# EAGLE design motortreiber (EAGLE 7.5.0)
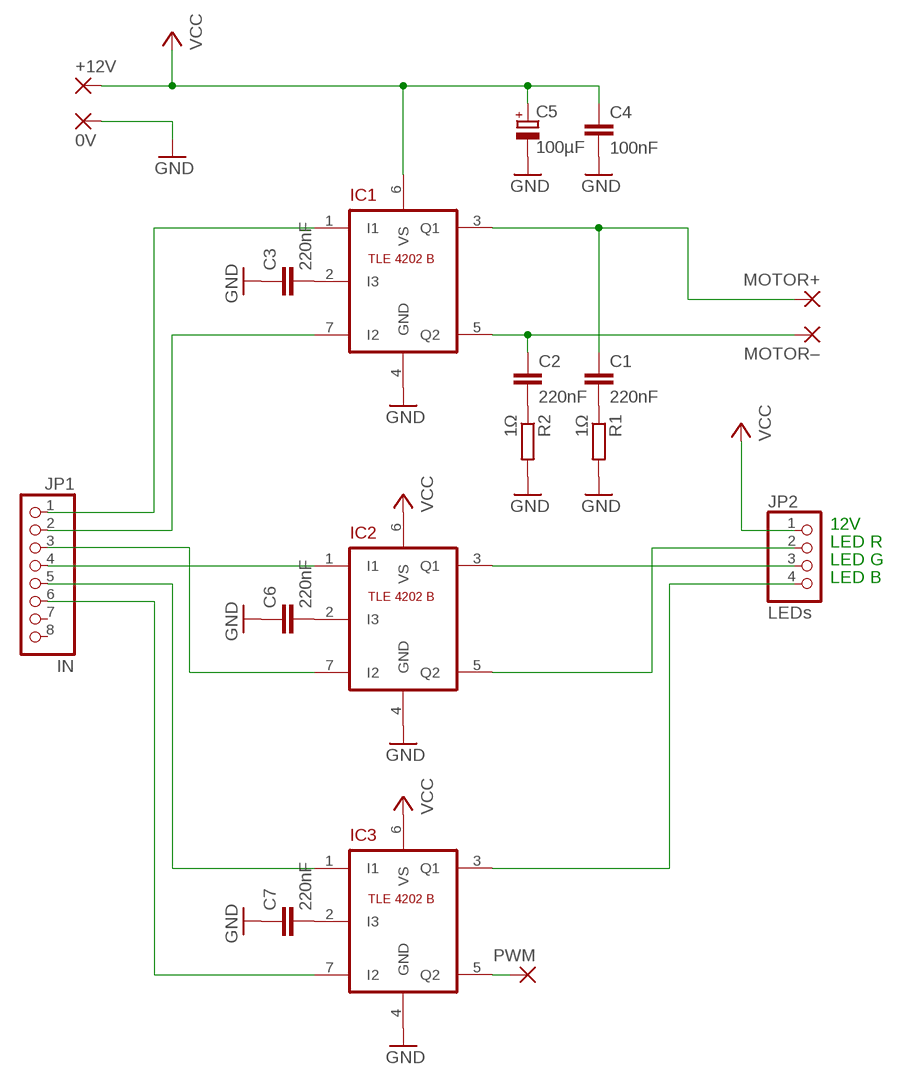
[diagram p0: schematic, sheet 1]

## Parts
0V  WIREPAD2,15/1,0  [2,15/1,0]
+12V  WIREPAD2,15/1,0  [2,15/1,0]
C1  220nF  C5/2.5  [C5B2.5]
C2  220nF  C5/2.5  [C5B2.5]
C3  220nF  C5/2.5  [C5B2.5]
C4  100nF  C2,5-3  [C2.5-3]
C5  100µF  CPOL-EUE2.5-5  [E2,5-5]
C6  220nF  C5/2.5  [C5B2.5]
C7  220nF  C5/2.5  [C5B2.5]
IC1  TLE-4202-B-100MIL  [TO-220-7-BREADBOARD]
IC2  TLE-4202-B-100MIL  [TO-220-7-BREADBOARD]
IC3  TLE-4202-B-100MIL  [TO-220-7-BREADBOARD]
JP1  IN  PINHD-1X8  [1X08]
JP2  LEDs  PINHD-1X4  [1X04]
MOTOR+  WIREPAD2,15/1,0  [2,15/1,0]
MOTOR–  WIREPAD2,15/1,0  [2,15/1,0]
PWM  WIREPAD2,15/1,0  [2,15/1,0]
R1  1Ω  R-EU_0204/7  [0204/7]
R2  1Ω  R-EU_0204/7  [0204/7]

## Nets
GND: 0V.1(P) C3.1 C4.2 C5.- C6.1 C7.1 IC1.4(GND) IC2.4(GND) IC3.4(GND) R1.2 R2.2
N$1: C1.1 IC1.3(Q1) MOTOR+.1(P)
N$2: C2.1 IC1.5(Q2) MOTOR–.1(P)
N$3: C3.2 IC1.2(I3)
N$4: IC1.1(I1) JP1.1
N$5: IC1.7(I2) JP1.2
N$6: C1.2 R1.1
N$7: C2.2 R2.1
N$8: IC2.1(I1) JP1.4
N$9: IC3.7(I2) JP1.6
N$10: IC3.1(I1) JP1.5
N$11: IC2.7(I2) JP1.3
N$12: C6.2 IC2.2(I3)
N$13: C7.2 IC3.2(I3)
N$17: IC3.5(Q2) PWM.1(P)
N$BOUT: IC3.3(Q1) JP2.4
N$GOUT: IC2.3(Q1) JP2.3
N$ROUT: IC2.5(Q2) JP2.2
VCC: +12V.1(P) C4.1 C5.+ IC1.6(VS) IC2.6(VS) IC3.6(VS) JP2.1
Unconnected: JP1.7 JP1.8

## Notes on the sheet
- 12V
- LED R
- LED G
- LED B

## Library data of the parts
0V +12V MOTOR+ MOTOR– PWM = wirepad:WIREPAD: Wire PAD connect wire on PCB
C1-C4 C6 C7 = capacitor-wima:C: CAPACITOR naming: grid - package width
C5 = rcl:CPOL-EU: POLARIZED CAPACITOR, European symbol
IC1-IC3 = siemens-tle-4202-b:TLE-4202-B: Siemens TLE 4202 B 2-A DC Motor Driver Data sheet (pollin.de) <http://www.pollin.de/shop/downloads/D101044D.PDF>
JP1 = pinhead:PINHD-1X8: PIN HEADER
JP2 = pinhead:PINHD-1X4: PIN HEADER
R1 R2 = resistor:R-EU_: RESISTOR, European symbol

## Board
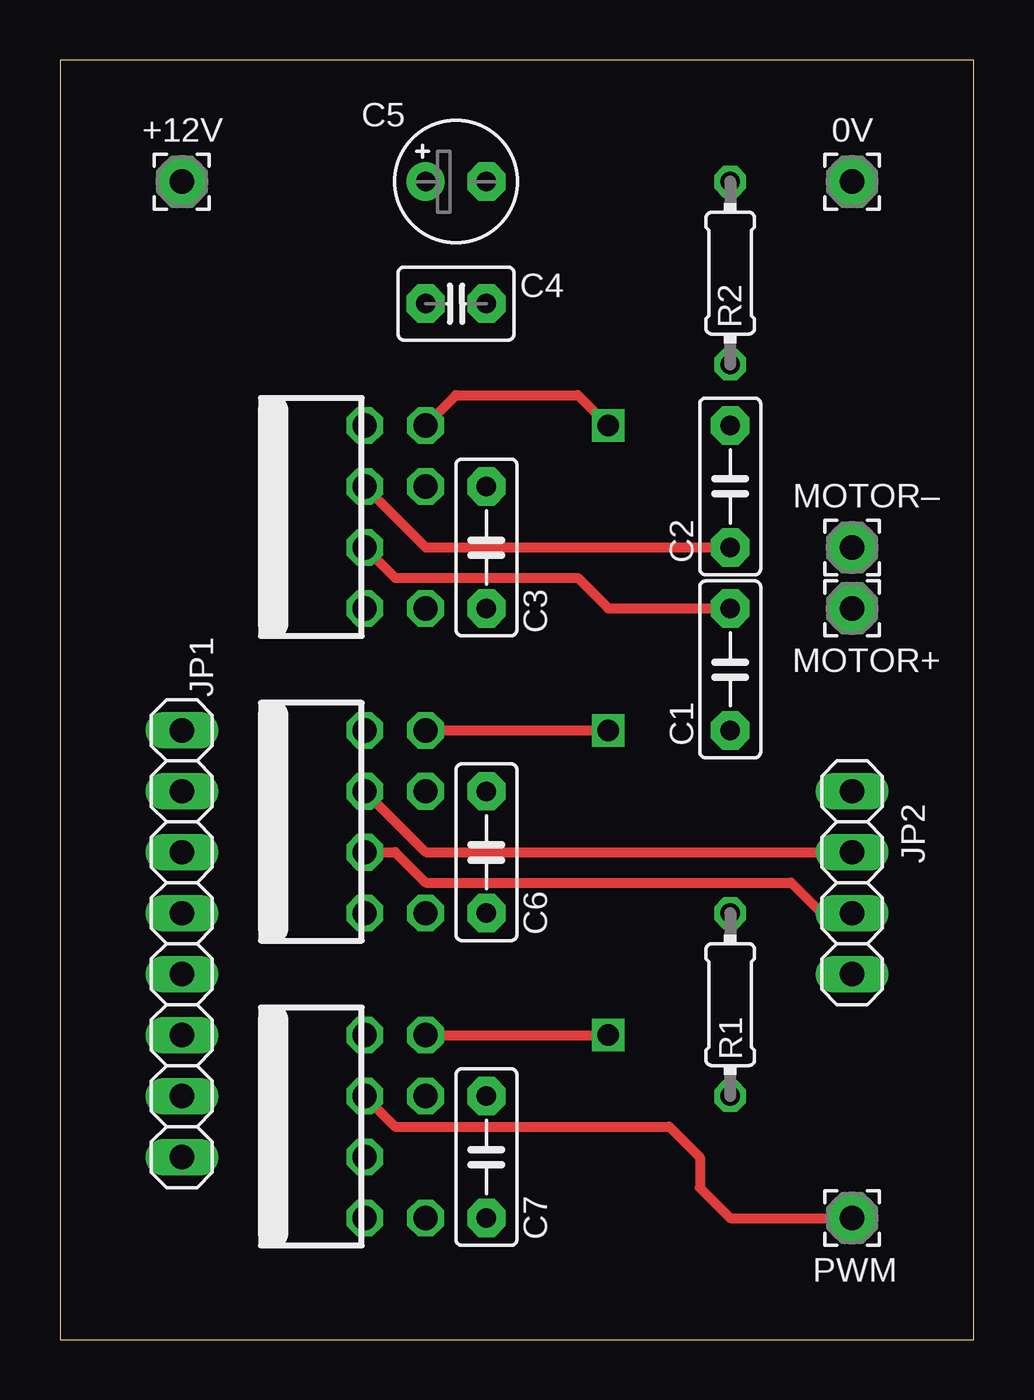
[diagram p1: board, top side]
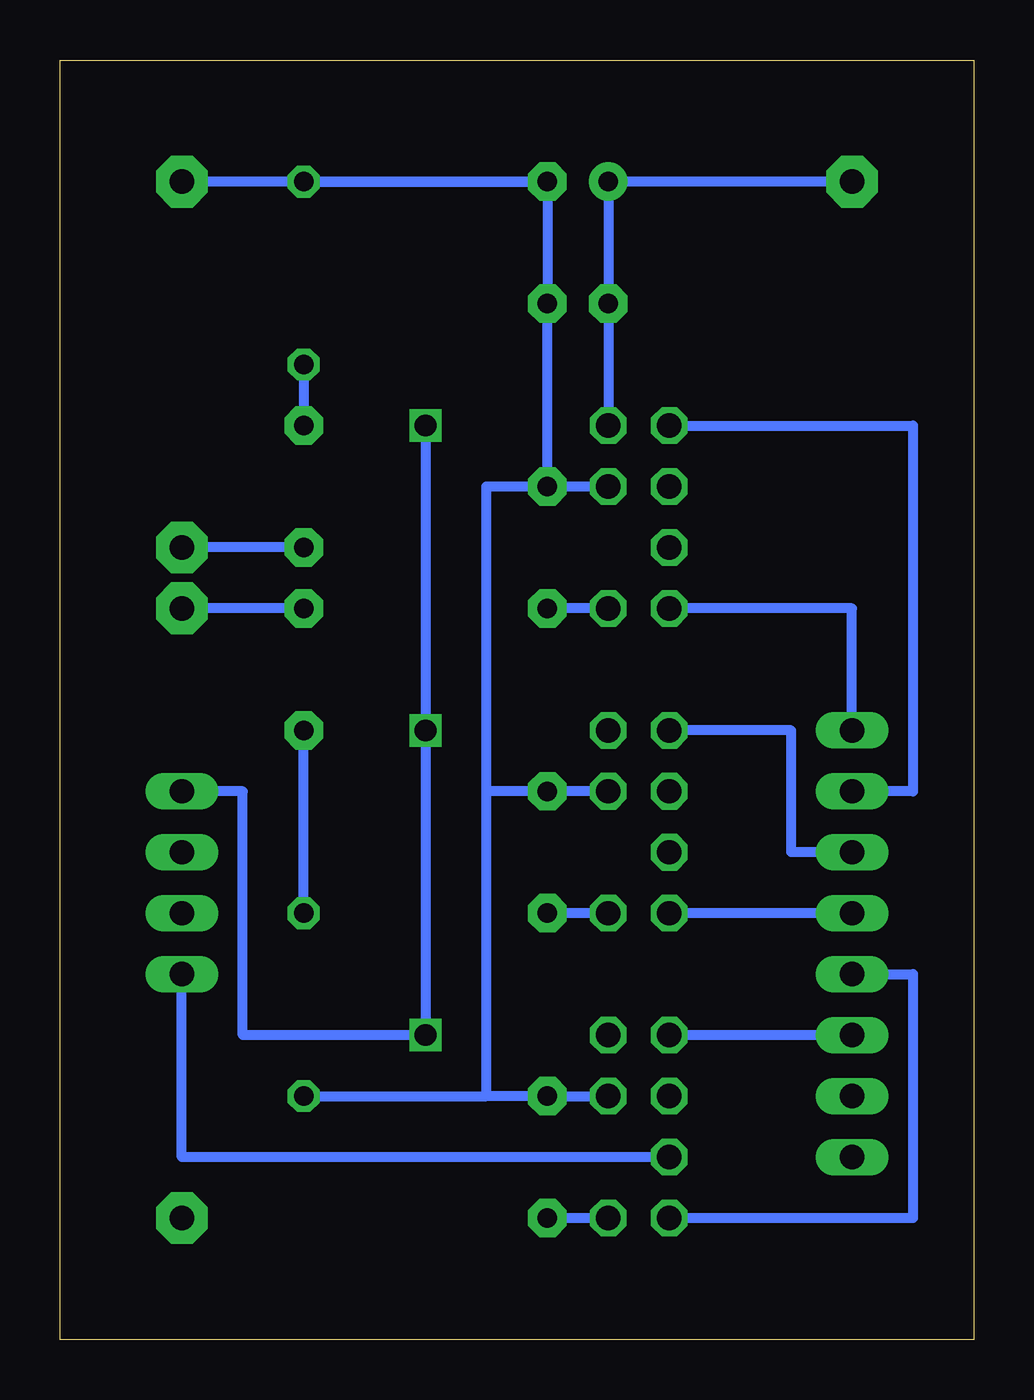
[diagram p2: board, bottom side, seen from below]

Size 38.1 x 53.33 mm. Coordinates in mm from the lower left corner, seen from the top.
Outline: 0,0 38.1,0 38.1,53.33 0,53.33 0,0
Copper layers (1*16): Top 0.035mm / dielectric 1.5mm / Bottom 0.035mm
Design rules "default": minimum track width 10mil, minimum drill 24mil, track to track 8mil, track to pad 8mil, pad to pad 8mil, via to via 8mil, smd to smd 8mil, copper to edge 40mil, drill to drill 8mil, minimum pad ring 10mil, minimum via ring 8mil, stop-mask expansion 4mil, vias tented up to drill 0mil, thermal gap 10mil

### Footprints (pad centres in the part's own frame; a part is rotated, then mirrored left to right if it is on the bottom)
2,15/1,0 = drill 1.016 pad 2.159 octagon: 1 0,0
C5B2.5 = drill 0.813 pad 1.6 octagon: 1 -2.54,0; 2 2.54,0
C2.5-3 = drill 0.813 pad 1.6 octagon: 1 -1.27,0; 2 1.27,0
E2,5-5 = drill 0.813 pad 1.6: + -1.27,0 | drill 0.813 pad 1.6 octagon: - 1.27,0
TO-220-7-BREADBOARD = drill 1.016 octagon: 1 0,2.54; 2 -2.54,2.54; 3 0,0; 4 -2.54,-2.54; 5 0,-2.54; 6 -2.54,-5.08; 7 0,-5.08
1X08 = drill 1.016 long: 1 -8.89,0; 2 -6.35,0; 3 -3.81,0; 4 -1.27,0; 5 1.27,0; 6 3.81,0; 7 6.35,0; 8 8.89,0
1X04 = drill 1.016 long: 1 -3.81,0; 2 -1.27,0; 3 1.27,0; 4 3.81,0
0204/7 = drill 0.813 octagon: 1 -3.81,0; 2 3.81,0

### Placement (x,y rotation side)
0V  33.02,48.26 180 top
+12V  5.08,48.26 0 top
C1  27.94,27.94 270 top
C2  27.94,35.56 90 top
C3  17.78,33.02 270 top
C4  16.51,43.18 0 top
C5  16.51,48.26 0 top
C6  17.78,20.32 270 top
C7  17.78,7.62 270 top
IC1  12.7,33.02 180 top
IC2  12.7,20.32 180 top
IC3  12.7,7.62 180 top
JP1  5.08,16.51 270 top
JP2  33.02,19.05 270 top
MOTOR+  33.02,30.48 180 top
MOTOR–  33.02,33.02 0 top
PWM  33.02,5.08 0 top
R1  27.94,13.97 270 top
R2  27.94,44.45 90 top

### Tracks (layer width: path | path; a pad name or v marks a point on that pad's centre or on a via)
GND
  Bottom 0.406: IC2.4 C6.1 20.32,22.86 | C5.- 0V.1 | R2.2 C5.- | C5.- C4.2 C3.1 | IC3.4 C7.1 20.32,10.16 | R1.2 20.32,10.16 | 20.32,10.16 20.32,22.86 | 20.32,22.86 20.32,35.56 C3.1 | C3.1 IC1.4
N$1
  Top 0.406: IC1.3 13.97,31.75 21.59,31.75 22.86,30.48 C1.1
  Bottom 0.406: C1.1 MOTOR+.1
N$2
  Top 0.406: IC1.5 15.24,33.02 C2.1
  Bottom 0.406: C2.1 MOTOR–.1
N$3
  Bottom 0.406: IC1.2 C3.2
N$4
  Bottom 0.406: JP1.1 5.08,30.48 IC1.1
N$5
  Bottom 0.406: IC1.7 2.54,38.1 2.54,22.86 JP1.2
N$6
  Bottom 0.406: R1.1 C1.2
N$7
  Bottom 0.406: R2.1 C2.2
N$8
  Bottom 0.406: JP1.4 IC2.1
N$9
  Bottom 0.406: JP1.6 IC3.7
N$10
  Bottom 0.406: JP1.5 2.54,15.24 2.54,5.08 IC3.1
N$11
  Bottom 0.406: JP1.3 7.62,20.32 7.62,25.4 IC2.7
N$12
  Bottom 0.406: IC2.2 C6.2
N$13
  Bottom 0.406: IC3.2 C7.2
N$17
  Top 0.406: IC3.5 13.97,8.89 25.4,8.89 26.67,7.62 26.67,6.35 27.94,5.08 PWM.1
N$BOUT
  Bottom 0.406: IC3.3 33.02,7.62 JP2.4
N$GOUT
  Top 0.406: IC2.3 13.97,20.32 15.24,19.05 30.48,19.05 31.75,17.78 JP2.3
N$ROUT
  Top 0.406: IC2.5 15.24,20.32 JP2.2
VCC  (via drill 0.9 pad 1.27)
  Top 0.406: IC1.6 16.51,39.37 21.59,39.37 v22.86,38.1 | IC2.6 v22.86,25.4 | IC3.6 v22.86,12.7
  Bottom 0.406: +12V.1 C5.+ C4.1 IC1.6 | v22.86,38.1 v22.86,25.4 v22.86,12.7 30.48,12.7 30.48,22.86 JP2.1